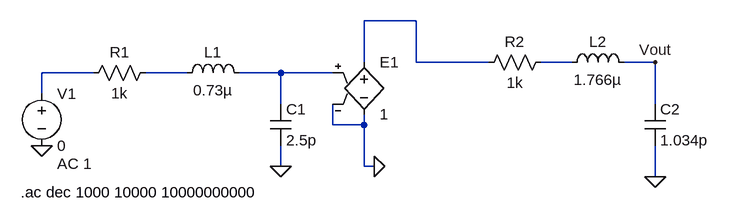
[diagram p0: schematic rlc_filter.asc]
rlc_filter.asc, the LTspice schematic file:
Version 4
SHEET 1 936 680
WIRE 464 -176 384 -176
WIRE 384 -112 384 -176
WIRE 464 -112 464 -176
WIRE 576 -112 464 -112
WIRE 704 -112 656 -112
WIRE 832 -112 784 -112
WIRE -32 -96 -112 -96
WIRE 112 -96 48 -96
WIRE 256 -96 192 -96
WIRE 336 -96 256 -96
WIRE -112 -64 -112 -96
WIRE 256 -48 256 -96
WIRE 832 -48 832 -112
WIRE 336 -16 336 -48
WIRE 384 -16 384 -32
WIRE 384 -16 336 -16
WIRE 256 48 256 16
WIRE 384 48 384 -16
WIRE 400 48 384 48
WIRE 832 64 832 16
FLAG 256 48 0
FLAG 832 64 0
FLAG -112 16 0
FLAG 400 48 0
FLAG 832 -112 Vout
SYMBOL res 64 -112 R90
WINDOW 0 0 56 VBottom 2
WINDOW 3 32 56 VTop 2
SYMATTR InstName R1
SYMATTR Value 1k
SYMBOL ind 96 -80 R270
WINDOW 0 32 56 VTop 2
WINDOW 3 5 56 VBottom 2
SYMATTR InstName L1
SYMATTR Value 0.73µ
SYMBOL cap 240 -48 R0
SYMATTR InstName C1
SYMATTR Value 2.5p
SYMBOL res 672 -128 R90
WINDOW 0 0 56 VBottom 2
WINDOW 3 32 56 VTop 2
SYMATTR InstName R2
SYMATTR Value 1k
SYMBOL ind 688 -96 R270
WINDOW 0 32 56 VTop 2
WINDOW 3 5 56 VBottom 2
SYMATTR InstName L2
SYMATTR Value 1.766µ
SYMBOL cap 816 -48 R0
SYMATTR InstName C2
SYMATTR Value 1.034p
SYMBOL voltage -112 -80 R0
WINDOW 123 24 124 Left 2
WINDOW 39 0 0 Left 0
SYMATTR Value2 AC 1
SYMATTR InstName V1
SYMATTR Value 0
SYMBOL e 384 -128 R0
SYMATTR InstName E1
SYMATTR Value 1
TEXT -144 88 Left 2 !.ac dec 1000 10000 10000000000

The netlist it stands for:
* rlc_filter.asc
R1 N004 N003 1k
L1 N004 N005 0.73µ
C1 N005 0 2.5p
R2 N002 N001 1k
L2 N002 Vout 1.766µ
C2 Vout 0 1.034p
V1 N003 0 0 AC 1
E1 N001 0 N005 0 1
.ac dec 1000 10000 10000000000
.backanno
.end